# EAGLE schematic ButtonBoard (EAGLE 9.6.2)
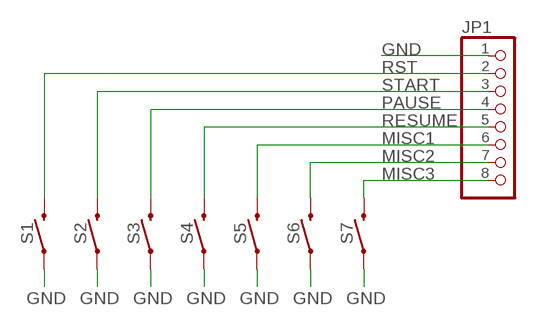
[diagram p0: schematic, sheet 1]

## Parts
JP1  PINHD-1X8/90  [1X08/90]
S1  MOMENTARY-SWITCH-SPST-SMD-12MM  [TACTILE_SWITCH_SMD_12MM]
S2  MOMENTARY-SWITCH-SPST-SMD-12MM  [TACTILE_SWITCH_SMD_12MM]
S3  MOMENTARY-SWITCH-SPST-SMD-12MM  [TACTILE_SWITCH_SMD_12MM]
S4  MOMENTARY-SWITCH-SPST-SMD-12MM  [TACTILE_SWITCH_SMD_12MM]
S5  MOMENTARY-SWITCH-SPST-SMD-12MM  [TACTILE_SWITCH_SMD_12MM]
S6  MOMENTARY-SWITCH-SPST-SMD-12MM  [TACTILE_SWITCH_SMD_12MM]
S7  MOMENTARY-SWITCH-SPST-SMD-12MM  [TACTILE_SWITCH_SMD_12MM]

## Nets
GND: JP1.1 S1.1 S2.1 S3.1 S4.1 S5.1 S6.1 S7.1
MISC1: JP1.6 S5.3
MISC2: JP1.7 S6.3
MISC3: JP1.8 S7.3
PAUSE: JP1.4 S3.3
RESUME: JP1.5 S4.3
RST: JP1.2 S1.3
START: JP1.3 S2.3

## Library data of the parts
JP1 = pinheadSpecial:PINHD-1X8: PIN HEADER
S1-S7 = SparkFun-Switches:MOMENTARY-SWITCH-SPST: Momentary Switch (Pushbutton) - SPST Normally-open (NO) SPST momentary switches (buttons, pushbuttons). Variants PTH-12MM - 12mm square, through-hole Momentary Pushbutton Switch - 12mm Square <https://www.sparkfun.com/products/9190> (COM-09190) PTH-6.0MM, PTH-6.0MM-KIT - 6.0mm square, through-hole Mini Pushbutton Switch <https://www.sparkfun.com/products/97> (COM-00097) KIT package intended for soldering kit's - only one side of pads' copper is exposed. PTH-RIGHT-ANGLE-KIT - Right-angle, through-hole Right Angle Tactile Button <https://www.sparkfun.com/products/10791> - Used on SparkFun BigTime Watch Kit <https://www.sparkfun.com/products/11734> SMD-12MM - 12mm square, surface-mount Tactile Button - SMD (12mm) <https://www.sparkfun.com/products/12993> (COM-12993) Used on SparkFun PicoBoard <https://www.sparkfun.com/products/11888> SMD-4.5MM - 4.5mm Square Trackball Switch Used on SparkFun Blackberry Trackballer Breakout <https://www.sparkfun.com/products/13169> SMD-4.6MMX2.8MM - 4.60mm x 2.80mm, surface mount Used on SparkFun Pro Micro - RP2040 <https://www.sparkfun.com/products/17717> SMD-5.2MM, SMD-5.2-REDUNDANT - 5.2mm square, surface-mount Mini Pushbutton Switch - SMD <https://www.sparkfun.com/products/8720> (COM-08720) Used on Arduino Pro Mini <https://www.sparkfun.com/products/11114> REDUNDANT package connects both switch circuits together SMD-6.0X3.5MM - 6.0 x 3.5mm, surface mount Momentary Reset Switch SMD <https://www.sparkfun.com/products/8229> (COM-08229) SMD-6.2MM-TALL - 6.2mm square, surface mount Tactile Button - SMD (6mm) <https://www.sparkfun.com/products/12992> Used on SparkFun Digital Sandbox <https://www.sparkfun.com/products/12651> SMD-RIGHT-ANGLE - Right-angle, surface mount Used on SparkFun Block for Intel® Edison - Arduino <https://www.sparkfun.com/products/13036>; PROD_ID: SWCH-11967; SF_SKU: COM-12993